# Altium schematic sheet PSoC Connections.SchDoc
size Letter
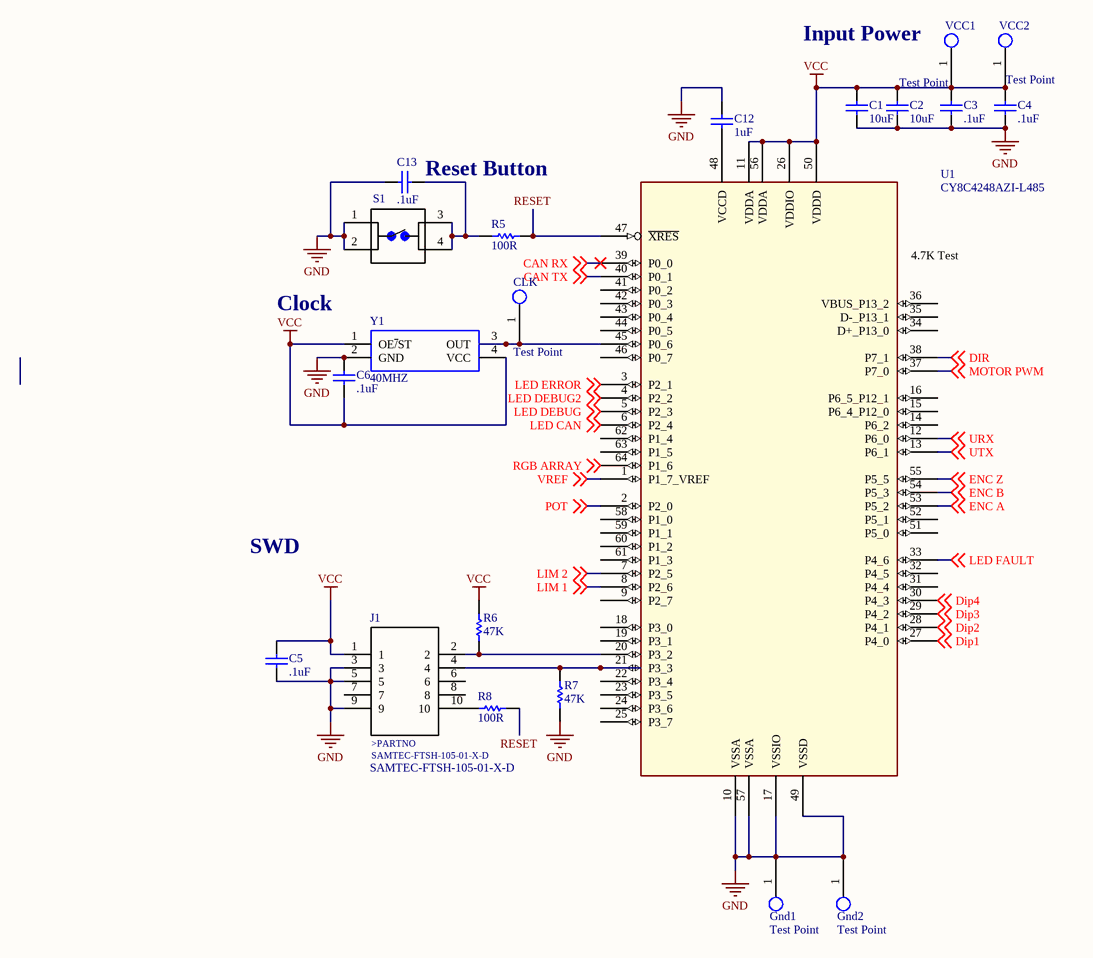
[diagram p0: PSoC Connections.SchDoc]

## Parts
C1  10uF  [CAPC0805(2012)130_N]
C2  10uF  [CAPC0805(2012)130_N]
C3  .1uF  [CAPC0805(2012)130_N]
C4  .1uF  [CAPC0805(2012)130_N]
C5  .1uF  [CAPC0805(2012)130_N]
C6  .1uF  [CAPC0805(2012)130_N]
C12  1uF  [CAPC0805(2012)130_N]
C13  .1uF  [CAPC0805(2012)130_N]
CLK  Test Point  [Test Point Through-hole]
Gnd1  Test Point  [Test Point Through-hole]
Gnd2  Test Point  [Test Point Through-hole]
J1  SAMTEC-FTSH-105-01-X-D  [SAMTEC-FTSH-105-01-X-D]
R5  100R  [RESC0805(2012)_N]
R6  47K  [RESC0805(2012)_N]
R7  47K  [RESC0805(2012)_N]
R8  100R  [RESC0805(2012)_N]
S1  1825910-7  [Switch 6mm 24V (NO)]  (value not drawn)
U1  CY8C4248AZI-L485  [TQFP50P1200X1200X160-64N]
VCC1  Test Point  [Test Point Through-hole]
VCC2  Test Point  [Test Point Through-hole]
Y1  40MHZ  [SG-636]

## Nets
GND: C1.1 C2.1 C3.1 C4.1 C5.1 C6.2 C12.2 C13.2 Gnd1.1 Gnd2.1 J1.3 J1.5 J1.9 R7.1 S1.1 S1.2 U1.10(VSSA) U1.17(VSSIO) U1.49(VSSD) U1.57(VSSA) Y1.2(GND)
VCC: C1.2 C2.2 C3.2 C4.2 C5.2 C6.1 J1.1 R6.2 U1.11(VDDA) U1.26(VDDIO) U1.50(VDDD) U1.56(VDDA) VCC1.1 VCC2.1 Y1.1(OE~{/}ST) Y1.4(VCC)
CAN RX: U1.39(P0_0) ; off-sheet CAN RX
CAN TX: U1.40(P0_1) ; off-sheet CAN TX
Dip1: U1.27(P4_0) ; off-sheet Dip1
Dip2: U1.28(P4_1) ; off-sheet Dip2
Dip3: U1.29(P4_2) ; off-sheet Dip3
Dip4: U1.30(P4_3) ; off-sheet Dip4
DIR: U1.38(P7_1) ; off-sheet DIR
ENC A: U1.53(P5_2) ; off-sheet ENC A
ENC B: U1.54(P5_3) ; off-sheet ENC B
ENC Z: U1.55(P5_5) ; off-sheet ENC Z
LED CAN: U1.6(P2_4) ; off-sheet LED CAN
LED DEBUG: U1.5(P2_3) ; off-sheet LED DEBUG
LED DEBUG2: U1.4(P2_2) ; off-sheet LED DEBUG2
LED ERROR: U1.3(P2_1) ; off-sheet LED ERROR
LED FAULT: U1.33(P4_6) ; off-sheet LED FAULT
LIM 1: U1.8(P2_6) ; off-sheet LIM 1
LIM 2: U1.7(P2_5) ; off-sheet LIM 2
MOTOR PWM: U1.37(P7_0) ; off-sheet MOTOR PWM
POT: U1.2(P2_0) ; off-sheet POT
RESET: R5.2 R8.2 U1.47(~{XRES})
RGB ARRAY: U1.64(P1_6) ; off-sheet RGB ARRAY
URX: U1.12(P6_0) ; off-sheet URX
UTX: U1.13(P6_1) ; off-sheet UTX
VREF: U1.1(P1_7_VREF) ; off-sheet VREF
NetC12_1: C12.1 U1.48(VCCD)
NetC13_1: C13.1 R5.1 S1.3 S1.4
NetCLK_1: CLK.1 U1.45(P0_6) Y1.3(OUT)
NetJ1_2: J1.2 R6.1 U1.20(P3_2)
NetJ1_4: J1.4 R7.2 U1.21(P3_3)
NetJ1_10: J1.10 R8.1

Not connected (* = marked no-connect by the designer): J1 6 7 8; U1 9(P2_7) 14(P6_2) 15(P6_4_P12_0) 16(P6_5_P12_1) 18(P3_0) 19(P3_1) 22(P3_4) 23(P3_5) 24(P3_6) 25(P3_7) 31(P4_4) 32(P4_5) 34(D+_P13_0) 35(D-_P13_1) 36(VBUS_P13_2) 41(P0_2) 42(P0_3) 43(P0_4) 44(P0_5) 46(P0_7) 51(P5_0) 52(P5_1) 58(P1_0) 59(P1_1) 60(P1_2) 61(P1_3) 62(P1_4) 63(P1_5)

## Notes on the sheet
- (near VCC1) Input Power
- (near C13) Reset Button
- Clock
- (near U1) 4.7K Test
- SWD
- Title
- Size:
- Date:
- Letter
- Number:
- Time:
- Revision:
- Sheet
- of
- File:
- (in symbol SAMTEC-FTSH-105-01-X-D) >PARTNO

## Library data of the parts
C1-C6 C12 C13 = CMP-1036-02603-1: CAP 390pF 200V ±5% 0805 (2012 Metric) Thickness 1.3mm SMD; Case-Metric: 2012; Case-EIA: 0805; Tolerance: Â±5%; Max Thickness: 1.3 mm; Rated Voltage: 200 V; Technology: SMT; Value: 390pF
R5 R7 R8 = 120R 5% 0805: 120R 0.125W 5% 0805 (2012 Metric)  SMD; Case-Metric: 2012; Value: 120.00 Ohm; Case-EIA: 0805; Tolerance: 5 %; Technology: SMT; Power: 0.125 W
R6 = 120R 5% 0805: 4.7K; Tolerance: 5 %; Case-Metric: 2012; Value: 120.00 Ohm; Case-EIA: 0805; Power: 0.125 W; Technology: SMT
S1 = Switch 6mm 24V (NO): FSM4JAH=6MM TACT SWITCH, HIGH TEMP; MF: TE Connectivity; Contact_Current_Rating: 50 mA; Configuration_Pole-Throw: Single Pole - Single Throw; Package: None; Digi-Key_Part_Number: 450-1804-ND; Digi-Key_Purchase_URL: https://www.digikey.com/product-detail/en/te-connectivity-alcoswitch-switches/1825910-7/450-1804-ND/1731414?utm_source=snapeda&utm_medium=aggregator&utm_campaign=symbol; MP: 1825910-7; SnapEDA_Link: https://www.snapeda.com/parts/1825910-7/TE%20Connectivity%20ALCOSWITCH%20Switches/view-part/?ref=snap; EU_RoHS_Compliance: Compliant; TE_purchase_URL: https://www.te.com/usa-en/product-1825910-7.html?te_bu=Cor&te_type=disp&te_campaign=seda_glo_cor-seda-global-disp-prtnr-fy19-seda-model-bom-cta_sma-317_1&elqCampaignId=32493; Value: *
Y1 = SG-636: Standard Clock Oscillators 50MHz 3.3Volt 100ppm -20C +70C; Manufacturer_Name: Epson Timing; Manufacturer_Part_Number: SG-636PCW 50.0000MC3: ROHS; RS Part Number: *; RS Price/Stock: *; Arrow Part Number: SG-636PCW 50.0000MC3: ROHS; Arrow Price/Stock: *; Datasheet Link: http://www.mouser.com/ds/2/137/G-636PCE_en-1003252.pdf
U1 = CY8C4248AZI-L485: Part_Number: CY8C4248AZI-L485